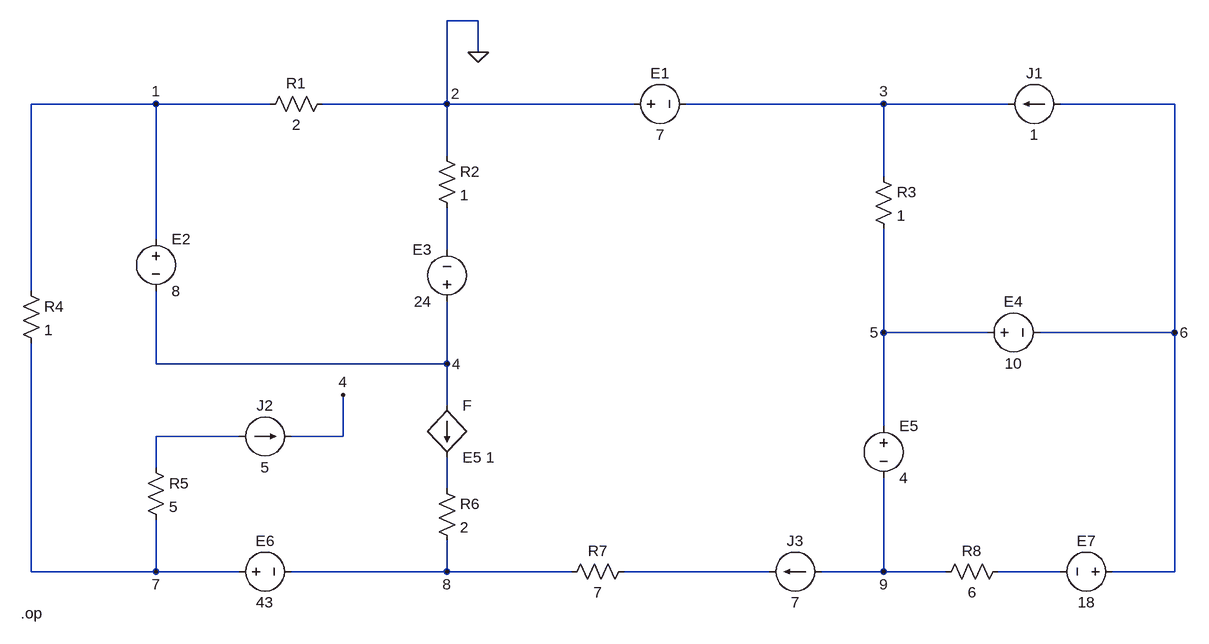
[diagram p0: schematic Circuitul_electric_rezistiv.asc]
Circuitul_electric_rezistiv.asc, the LTspice schematic file:
Version 4
SHEET 1 2972 764
WIRE 144 -240 96 -240
WIRE 144 -192 144 -240
WIRE -352 -112 -544 -112
WIRE -176 -112 -352 -112
WIRE 96 -112 96 -240
WIRE 96 -112 -96 -112
WIRE 384 -112 96 -112
WIRE 768 -112 464 -112
WIRE 960 -112 768 -112
WIRE 1216 -112 1040 -112
WIRE 96 -32 96 -112
WIRE 768 0 768 -112
WIRE -352 96 -352 -112
WIRE 96 112 96 48
WIRE -544 176 -544 -112
WIRE 768 240 768 80
WIRE 928 240 768 240
WIRE 1216 240 1216 -112
WIRE 1216 240 1008 240
WIRE -352 288 -352 176
WIRE 96 288 96 192
WIRE 96 288 -352 288
WIRE 96 352 96 288
WIRE 768 384 768 240
WIRE -224 400 -352 400
WIRE -64 400 -64 336
WIRE -64 400 -144 400
WIRE -352 448 -352 400
WIRE 96 480 96 432
WIRE -544 608 -544 256
WIRE -352 608 -352 528
WIRE -352 608 -544 608
WIRE -224 608 -352 608
WIRE 96 608 96 560
WIRE 96 608 -144 608
WIRE 288 608 96 608
WIRE 592 608 368 608
WIRE 768 608 768 464
WIRE 768 608 672 608
WIRE 864 608 768 608
WIRE 1040 608 944 608
WIRE 1216 608 1216 240
WIRE 1216 608 1120 608
FLAG 96 -112 2
FLAG 768 -112 3
FLAG 96 288 4
FLAG 768 240 5
FLAG 1216 240 6
FLAG -352 608 7
FLAG 96 608 8
FLAG 768 608 9
FLAG -352 -112 1
FLAG -64 336 4
FLAG 144 -192 0
SYMBOL voltage 96 208 R180
WINDOW 0 24 96 Left 2
WINDOW 3 24 16 Left 2
SYMATTR InstName E3
SYMATTR Value 24
SYMBOL res 80 -48 R0
SYMATTR InstName R2
SYMATTR Value 1
SYMBOL res 80 464 R0
SYMATTR InstName R6
SYMATTR Value 2
SYMBOL voltage -240 608 R270
WINDOW 0 32 56 VTop 2
WINDOW 3 -32 56 VBottom 2
SYMATTR InstName E6
SYMATTR Value 43
SYMBOL voltage 368 -112 R270
WINDOW 0 32 56 VTop 2
WINDOW 3 -32 56 VBottom 2
SYMATTR InstName E1
SYMATTR Value 7
SYMBOL res 384 592 R90
WINDOW 0 0 56 VBottom 2
WINDOW 3 32 56 VTop 2
SYMATTR InstName R7
SYMATTR Value 7
SYMBOL current 672 608 R90
WINDOW 0 -32 40 VBottom 2
WINDOW 3 32 40 VTop 2
SYMATTR InstName J3
SYMATTR Value 7
SYMBOL res 752 -16 R0
SYMATTR InstName R3
SYMATTR Value 1
SYMBOL voltage 768 368 R0
SYMATTR InstName E5
SYMATTR Value 4
SYMBOL current 1040 -112 R90
WINDOW 0 -32 40 VBottom 2
WINDOW 3 32 40 VTop 2
SYMATTR InstName J1
SYMATTR Value 1
SYMBOL voltage 912 240 R270
WINDOW 0 32 56 VTop 2
WINDOW 3 -32 56 VBottom 2
SYMATTR InstName E4
SYMATTR Value 10
SYMBOL res 960 592 R90
WINDOW 0 0 56 VBottom 2
WINDOW 3 32 56 VTop 2
SYMATTR InstName R8
SYMATTR Value 6
SYMBOL voltage 1136 608 R90
WINDOW 0 -32 56 VBottom 2
WINDOW 3 32 56 VTop 2
SYMATTR InstName E7
SYMATTR Value 18
SYMBOL voltage -352 80 R0
SYMATTR InstName E2
SYMATTR Value 8
SYMBOL res -368 432 R0
SYMATTR InstName R5
SYMATTR Value 5
SYMBOL current -224 400 R270
WINDOW 0 32 40 VTop 2
WINDOW 3 -32 40 VBottom 2
SYMATTR InstName J2
SYMATTR Value 5
SYMBOL res -560 160 R0
SYMATTR InstName R4
SYMATTR Value 1
SYMBOL res -80 -128 R90
WINDOW 0 0 56 VBottom 2
WINDOW 3 32 56 VTop 2
SYMATTR InstName R1
SYMATTR Value 2
SYMBOL f 96 352 R0
SYMATTR InstName F
SYMATTR Value E5 1
TEXT -560 672 Left 2 !.op

The netlist it stands for:
* Circuitul_electric_rezistiv.asc
V§E3 4 N001 24
R2 0 N001 1
R6 N003 8 2
V§E6 7 8 43
V§E1 0 3 7
R7 N004 8 7
I§J3 9 N004 7
R3 3 5 1
V§E5 5 9 4
I§J1 6 3 1
V§E4 5 6 10
R8 N005 9 6
V§E7 6 N005 18
V§E2 1 4 8
R5 N002 7 5
I§J2 N002 4 5
R4 1 7 1
R1 0 1 2
F 4 N003 E5 1
.op
.backanno
.end